# Altium project PCB_Control.V03.R00.PrjPcb (part 3 of 3)
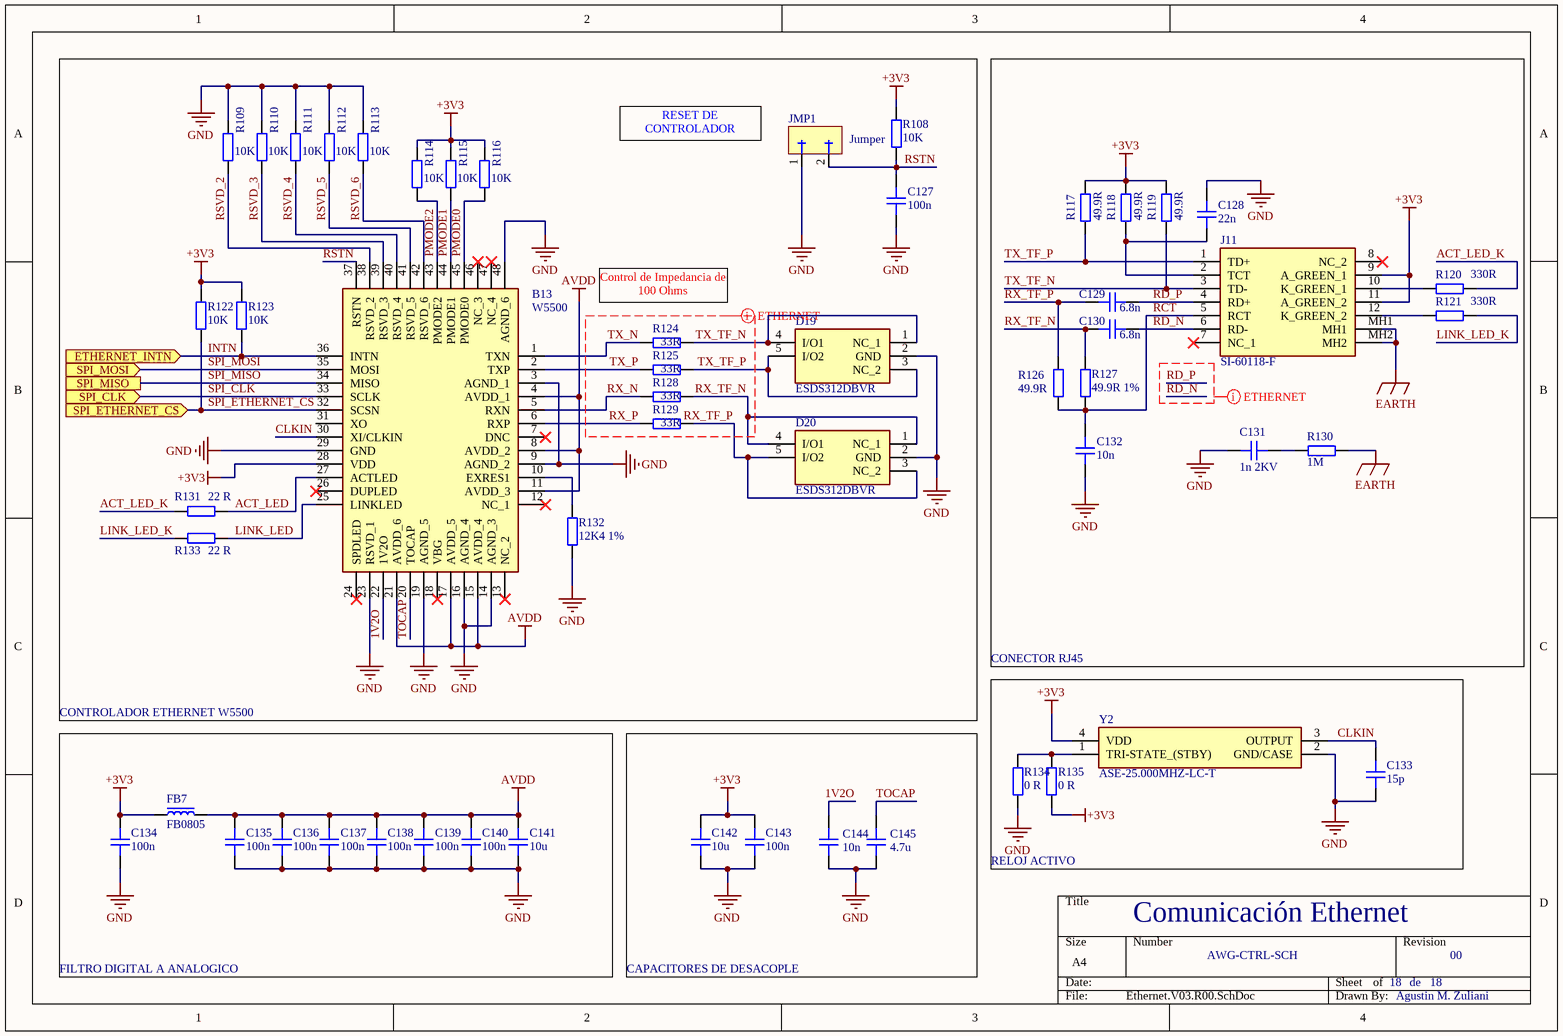
[diagram p18: Ethernet.V03.R00.SchDoc]

## Nets that join several sheets
+3V3: Control-Principal.V03.R00 (5 pins), Microcontrolador.V03.R00 (23 pins), SI5351.V03.R00 (B7.1 B7.7 C53#1.2 C54#1.2), DDS_CANAL1/DDS (6 pins), SY55857L.V03.R00 (7 pins), DAC_OFFSET_CANAL1 (C66#1.1 C67#1.A R59#1.2 U5.3), DDS_CANAL2/DDS (6 pins), DAC_OFFSET_CANAL2 (C68#2.1 C69#2.A R61#2.2 U6.3), Alimentacion.V03.R00 (5 pins), ConexionesPanelFrontal.V03.R00 (10 pins), MemoriaEEPROM.V03.R00 (7 pins), Ethernet.V03.R00 (18 pins)
+3V3_CONN: Microcontrolador.V03.R00 (D4.2), Alimentacion.V03.R00 (D9.1 J9.11 J9.12 TP54.1)
+5V: Microcontrolador.V03.R00 (5 pins), Alimentacion.V03.R00 (5 pins), ConexionesPanelFrontal.V03.R00 (J6.1 J7.1)
+5V_CONN: Microcontrolador.V03.R00 (D3.2), Alimentacion.V03.R00 (D10.1 J9.4 TP53.1)
+A3V3: DDS_CANAL1/DDS (5 pins), OPA41971.V03.R00 (R54#2.1 R59#2.1), DDS_CANAL2/DDS (5 pins), Alimentacion.V03.R00 (5 pins)
+A5V: DDS_CANAL1/Conversor_Diff_A_Simple (8 pins), DDS_CANAL1/Atenuador_Digital_Pasos (7 pins), DDS_CANAL1/Offset (8 pins), BNC-OUTPUT.V03.R00 (D7.1 D8.1 RLY1.8 RLY2.8), DDS_CANAL2/Conversor_Diff_A_Simple (8 pins), DDS_CANAL2/Atenuador_Digital_Pasos (7 pins), DDS_CANAL2/Offset (8 pins), Alimentacion.V03.R00 (5 pins), ReferenciaTensionDDS.V03.R00 (6 pins)
+A15V: DDS_CANAL1/Amplificador (6 pins), OPA41971.V03.R00 (B8#2.4 C67#2.2 C68#1.2), DDS_CANAL2/Amplificador (6 pins), Alimentacion.V03.R00 (6 pins)
-A5V: DDS_CANAL1/Conversor_Diff_A_Simple (8 pins), DDS_CANAL1/Offset (8 pins), DDS_CANAL2/Conversor_Diff_A_Simple (8 pins), DDS_CANAL2/Offset (8 pins), Alimentacion.V03.R00 (5 pins)
-A15V: DDS_CANAL1/Amplificador (6 pins), OPA41971.V03.R00 (B8#2.11 C69#1.2 C70.2), DDS_CANAL2/Amplificador (6 pins), Alimentacion.V03.R00 (6 pins)
GND: Control-Principal.V03.R00 (R8#1.1), Microcontrolador.V03.R00 (37 pins), SI5351.V03.R00 (5 pins), DDS_CANAL1/DDS (22 pins), DDS_CANAL1/Conversor_Diff_A_Simple (10 pins), DDS_CANAL1/Atenuador_Digital_Pasos (20 pins), DDS_CANAL1/Offset (12 pins), DDS_CANAL1/Amplificador (11 pins), SY55857L.V03.R00 (9 pins), DAC_OFFSET_CANAL1 (C66#1.2 C67#1.K R60#1.1 U5.2), OPA41971.V03.R00 (10 pins), BNC-OUTPUT.V03.R00 (10 pins), DDS_CANAL2/DDS (22 pins), DDS_CANAL2/Conversor_Diff_A_Simple (10 pins), DDS_CANAL2/Atenuador_Digital_Pasos (20 pins), DDS_CANAL2/Offset (12 pins), DDS_CANAL2/Amplificador (11 pins), DAC_OFFSET_CANAL2 (C68#2.2 C69#2.K R62.1 U6.2), Alimentacion.V03.R00 (46 pins), ConexionesPanelFrontal.V03.R00 (8 pins), ReferenciaTensionDDS.V03.R00 (13 pins), MemoriaEEPROM.V03.R00 (7 pins), Ethernet.V03.R00 (36 pins)
AD9102_CLK_N: DDS_CANAL1/DDS (B16.20), SY55857L.V03.R00 (C55#2.1)
AD9102_CLK_N: SY55857L.V03.R00 (C57#1.1), DDS_CANAL2/DDS (B17.20)
AD9102_CLK_P: DDS_CANAL1/DDS (B16.21), SY55857L.V03.R00 (C56#1.1)
AD9102_CLK_P: SY55857L.V03.R00 (C58#1.1), DDS_CANAL2/DDS (B17.21)
AMPL_VOUT: DDS_CANAL1/Amplificador (R8#2.2 R11#2.2 TP15#2.1), BNC-OUTPUT.V03.R00 (RLY2.4)
AMPL_VOUT: BNC-OUTPUT.V03.R00 (RLY1.4), DDS_CANAL2/Amplificador (R14#2.2 R17#2.2 TP19#2.1)
BUZZER: Microcontrolador.V03.R00 (U3#1.30), ConexionesPanelFrontal.V03.R00 (J8.5)
CH1_EN: Microcontrolador.V03.R00 (U3#1.8), BNC-OUTPUT.V03.R00 (R73#2.2)
CH2_EN: Microcontrolador.V03.R00 (U3#1.9), BNC-OUTPUT.V03.R00 (R75#1.2)
DAC_DC_VIN: DDS_CANAL1/Offset (R70.1 TP60#1.1), OPA41971.V03.R00 (B8#2.13 B8#2.14)
DAC_DC_VIN: OPA41971.V03.R00 (B8#2.8 B8#2.9), DDS_CANAL2/Offset (R75#2.1 TP65#1.1)
DDS_IOUT_N: DDS_CANAL1/DDS (B16.28 C146.1 R110#1.2), DDS_CANAL1/Conversor_Diff_A_Simple (B2#2.3)
DDS_IOUT_N: DDS_CANAL2/DDS (B17.28 C160.1 R113#1.2), DDS_CANAL2/Conversor_Diff_A_Simple (B4.3)
DDS_IOUT_P: DDS_CANAL1/DDS (B16.27 C145#1.1 R109#1.2), DDS_CANAL1/Conversor_Diff_A_Simple (B2#2.5)
DDS_IOUT_P: DDS_CANAL2/DDS (B17.27 C159.1 R112#1.2), DDS_CANAL2/Conversor_Diff_A_Simple (B4.5)
DDS_REFIO_CH1: Control-Principal.V03.R00 (TP3.1), DDS_CANAL1/DDS (B16.18), ReferenciaTensionDDS.V03.R00 (R94#2.2)
DDS_REFIO_CH2: Control-Principal.V03.R00 (TP4.1), DDS_CANAL2/DDS (B17.18), ReferenciaTensionDDS.V03.R00 (R98#2.2)
DDS_VOUT: DDS_CANAL1 (R22.1 R23.1 R24.1), DDS_CANAL1/Conversor_Diff_A_Simple (B3.6 R51.2 TP46.1)
DDS_VOUT: DDS_CANAL2 (R25.1 R26.1 R27.1), DDS_CANAL2/Conversor_Diff_A_Simple (B5.6 R55#2.2 TP48.1)
DSA_CLK: Control-Principal.V03.R00 (TP6.1), Microcontrolador.V03.R00 (U3#1.17), DDS_CANAL1/Atenuador_Digital_Pasos (B13#1.4), DDS_CANAL2/Atenuador_Digital_Pasos (B14.4)
DSA_DATA: Control-Principal.V03.R00 (TP5.1), Microcontrolador.V03.R00 (U3#1.14), DDS_CANAL1/Atenuador_Digital_Pasos (C117#1.2 R94#1.1 R95#1.1), DDS_CANAL2/Atenuador_Digital_Pasos (C128#1.2 R103#1.1 R104#1.1)
DSA_LE_1: Control-Principal.V03.R00 (TP7.1), Microcontrolador.V03.R00 (U3#1.18), DDS_CANAL1/Atenuador_Digital_Pasos (B13#1.5)
DSA_LE_2: Control-Principal.V03.R00 (TP8.1), Microcontrolador.V03.R00 (U3#1.27), DDS_CANAL2/Atenuador_Digital_Pasos (B14.5)
DSA_VOUT: DDS_CANAL1 (R22.2), DDS_CANAL1/Atenuador_Digital_Pasos (B13#1.14 TP75.1), DDS_CANAL1/Offset (B8#1.3 R73#1.2 R74#1.1)
DSA_VOUT: DDS_CANAL2 (R25.2), DDS_CANAL2/Atenuador_Digital_Pasos (B14.14 TP79.1), DDS_CANAL2/Offset (B10.3 R78#1.2 R79#1.1)
ENCODER_A: Microcontrolador.V03.R00 (U3#1.34), ConexionesPanelFrontal.V03.R00 (J8.7)
ENCODER_B: Microcontrolador.V03.R00 (U3#1.35), ConexionesPanelFrontal.V03.R00 (J8.9)
ETH_INTN: Control-Principal.V03.R00 (R9#1.2), Ethernet.V03.R00 (B13#2.36 R123.2)
I2C_SCL: Control-Principal.V03.R00 (R11#1.1 R140.1 TP10.1), SI5351.V03.R00 (B7.4), DAC_OFFSET_CANAL1 (U5.5), DAC_OFFSET_CANAL2 (U6.5), MemoriaEEPROM.V03.R00 (U9.6)
I2C_SDA: Control-Principal.V03.R00 (R10#1.1 R139.1 TP9.1), SI5351.V03.R00 (B7.5), DAC_OFFSET_CANAL1 (U5.4), DAC_OFFSET_CANAL2 (U6.4), MemoriaEEPROM.V03.R00 (U9.5)
INTA: Control-Principal.V03.R00 (R1.1), ConexionesPanelFrontal.V03.R00 (B11#2.20 R83.1)
INTB: Control-Principal.V03.R00 (R2.1), ConexionesPanelFrontal.V03.R00 (B11#2.19 R84.1)
LCD_RESET: Control-Principal.V03.R00 (R6#1.2 R8#1.2), ConexionesPanelFrontal.V03.R00 (J6.16)
MCP4725_VOUT: DAC_OFFSET_CANAL1 (TP50.1 U5.1), OPA41971.V03.R00 (R55#1.1)
MCP4725_VOUT: OPA41971.V03.R00 (R60#2.1), DAC_OFFSET_CANAL2 (TP51#1.1 U6.1)
MCU_GPIO0: Control-Principal.V03.R00 (R141.2), Microcontrolador.V03.R00 (J3.1 U3#1.2)
MCU_GPIO1: Control-Principal.V03.R00 (R142.2), Microcontrolador.V03.R00 (J3.3 U3#1.3)
MCU_GPIO2: Control-Principal.V03.R00 (R136.2 TP12.1), Microcontrolador.V03.R00 (U3#1.4)
MCU_GPIO3: Control-Principal.V03.R00 (R137.2 TP13.1), Microcontrolador.V03.R00 (U3#1.5)
MCU_GPIO4: Control-Principal.V03.R00 (R138.2 TP14#1.1), Microcontrolador.V03.R00 (U3#1.6)
MCU_GPIO5: Control-Principal.V03.R00 (TP16#1.1), Microcontrolador.V03.R00 (U3#1.7), DDS_CANAL1/DDS (B16.8)
MCU_GPIO8: Control-Principal.V03.R00 (D1.K), Microcontrolador.V03.R00 (U3#1.11)
MCU_GPIO9: Control-Principal.V03.R00 (TP17#1.1), Microcontrolador.V03.R00 (U3#1.12), DDS_CANAL2/DDS (B17.8)
MCU_GPIO10: Control-Principal.V03.R00 (D2.K), Microcontrolador.V03.R00 (U3#1.13)
MCU_GPIO12: Control-Principal.V03.R00 (R139.2), Microcontrolador.V03.R00 (U3#1.15)
MCU_GPIO13: Control-Principal.V03.R00 (R140.2), Microcontrolador.V03.R00 (U3#1.16)
MCU_GPIO17: Control-Principal.V03.R00 (TP19#1.1), Microcontrolador.V03.R00 (U3#1.28), ConexionesPanelFrontal.V03.R00 (J6.13)
MCU_GPIO18: Control-Principal.V03.R00 (TP20#1.1), Microcontrolador.V03.R00 (U3#1.29), ConexionesPanelFrontal.V03.R00 (B11#2.11)
MCU_GPIO20: Control-Principal.V03.R00 (R143.2), Microcontrolador.V03.R00 (U3#1.31)
MCU_GPIO21: Control-Principal.V03.R00 (R144.2), Microcontrolador.V03.R00 (U3#1.32)
MCU_GPIO24: Control-Principal.V03.R00 (R1.2 R3.1), Microcontrolador.V03.R00 (U3#1.36), DDS_CANAL1 (TP22#2.1), DDS_CANAL1/DDS (B16.32)
MCU_GPIO25: Control-Principal.V03.R00 (R2.2 R4.1 R9#1.1), Microcontrolador.V03.R00 (U3#1.37)
MCU_GPIO26: Control-Principal.V03.R00 (TP21#1.1), Microcontrolador.V03.R00 (U3#1.38), ReferenciaTensionDDS.V03.R00 (B12.6)
MCU_GPIO27: Microcontrolador.V03.R00 (U3#1.39), ConexionesPanelFrontal.V03.R00 (J6.14)
MCU_GPIO28: Microcontrolador.V03.R00 (U3#1.40), ConexionesPanelFrontal.V03.R00 (J6.15)
MCU_GPIO29: Control-Principal.V03.R00 (TP68#1.1), Microcontrolador.V03.R00 (U3#1.41), Ethernet.V03.R00 (B13#2.32 R122.2)
NetB17_32: Control-Principal.V03.R00 (R3.2 R4.2), DDS_CANAL2 (TP23#2.1), DDS_CANAL2/DDS (B17.32)
NEXTION_RX: Control-Principal.V03.R00 (R5.2), ConexionesPanelFrontal.V03.R00 (J7.3)
NEXTION_TX: Control-Principal.V03.R00 (R7#1.2), ConexionesPanelFrontal.V03.R00 (J7.2)
OFFSET_VOUT: DDS_CANAL1/Offset (B9.6 R71.2 TP62#1.1), DDS_CANAL1/Amplificador (R7#2.1 R10#2.1)
OFFSET_VOUT: DDS_CANAL2/Offset (B11#1.6 R76#2.2 TP67#1.1), DDS_CANAL2/Amplificador (R13#2.1 R16#2.1)
PE4312_RFIN: DDS_CANAL1 (R23.2 R24.2), DDS_CANAL1/Atenuador_Digital_Pasos (B13#1.2 TP74.1)
PE4312_RFIN: DDS_CANAL2 (R26.2 R27.2), DDS_CANAL2/Atenuador_Digital_Pasos (B14.2 TP78.1)
SI5351_CLK0: Control-Principal.V03.R00 (TP1.1), SI5351.V03.R00 (B7.10), SY55857L.V03.R00 (U4#1.1)
SI5351_CLK1: Control-Principal.V03.R00 (TP2.1), SI5351.V03.R00 (B7.9), SY55857L.V03.R00 (U4#1.3)
SPI_CLK: Control-Principal.V03.R00 (R136.1), DDS_CANAL1/DDS (B16.1), DDS_CANAL2/DDS (B17.1), ConexionesPanelFrontal.V03.R00 (B11#2.12 J6.11), ReferenciaTensionDDS.V03.R00 (B12.7), Ethernet.V03.R00 (B13#2.33)
SPI_MISO: Control-Principal.V03.R00 (R138.1), DDS_CANAL1/DDS (B16.7), DDS_CANAL2/DDS (B17.7), ConexionesPanelFrontal.V03.R00 (B11#2.14 J6.9), Ethernet.V03.R00 (B13#2.34)
SPI_MOSI: Control-Principal.V03.R00 (R137.1), DDS_CANAL1/DDS (B16.2), DDS_CANAL2/DDS (B17.2), ConexionesPanelFrontal.V03.R00 (B11#2.13 J6.7), ReferenciaTensionDDS.V03.R00 (B12.8), Ethernet.V03.R00 (B13#2.35)